# Altium schematic sheet CANnode.SchDoc
size 711 x 609 mm
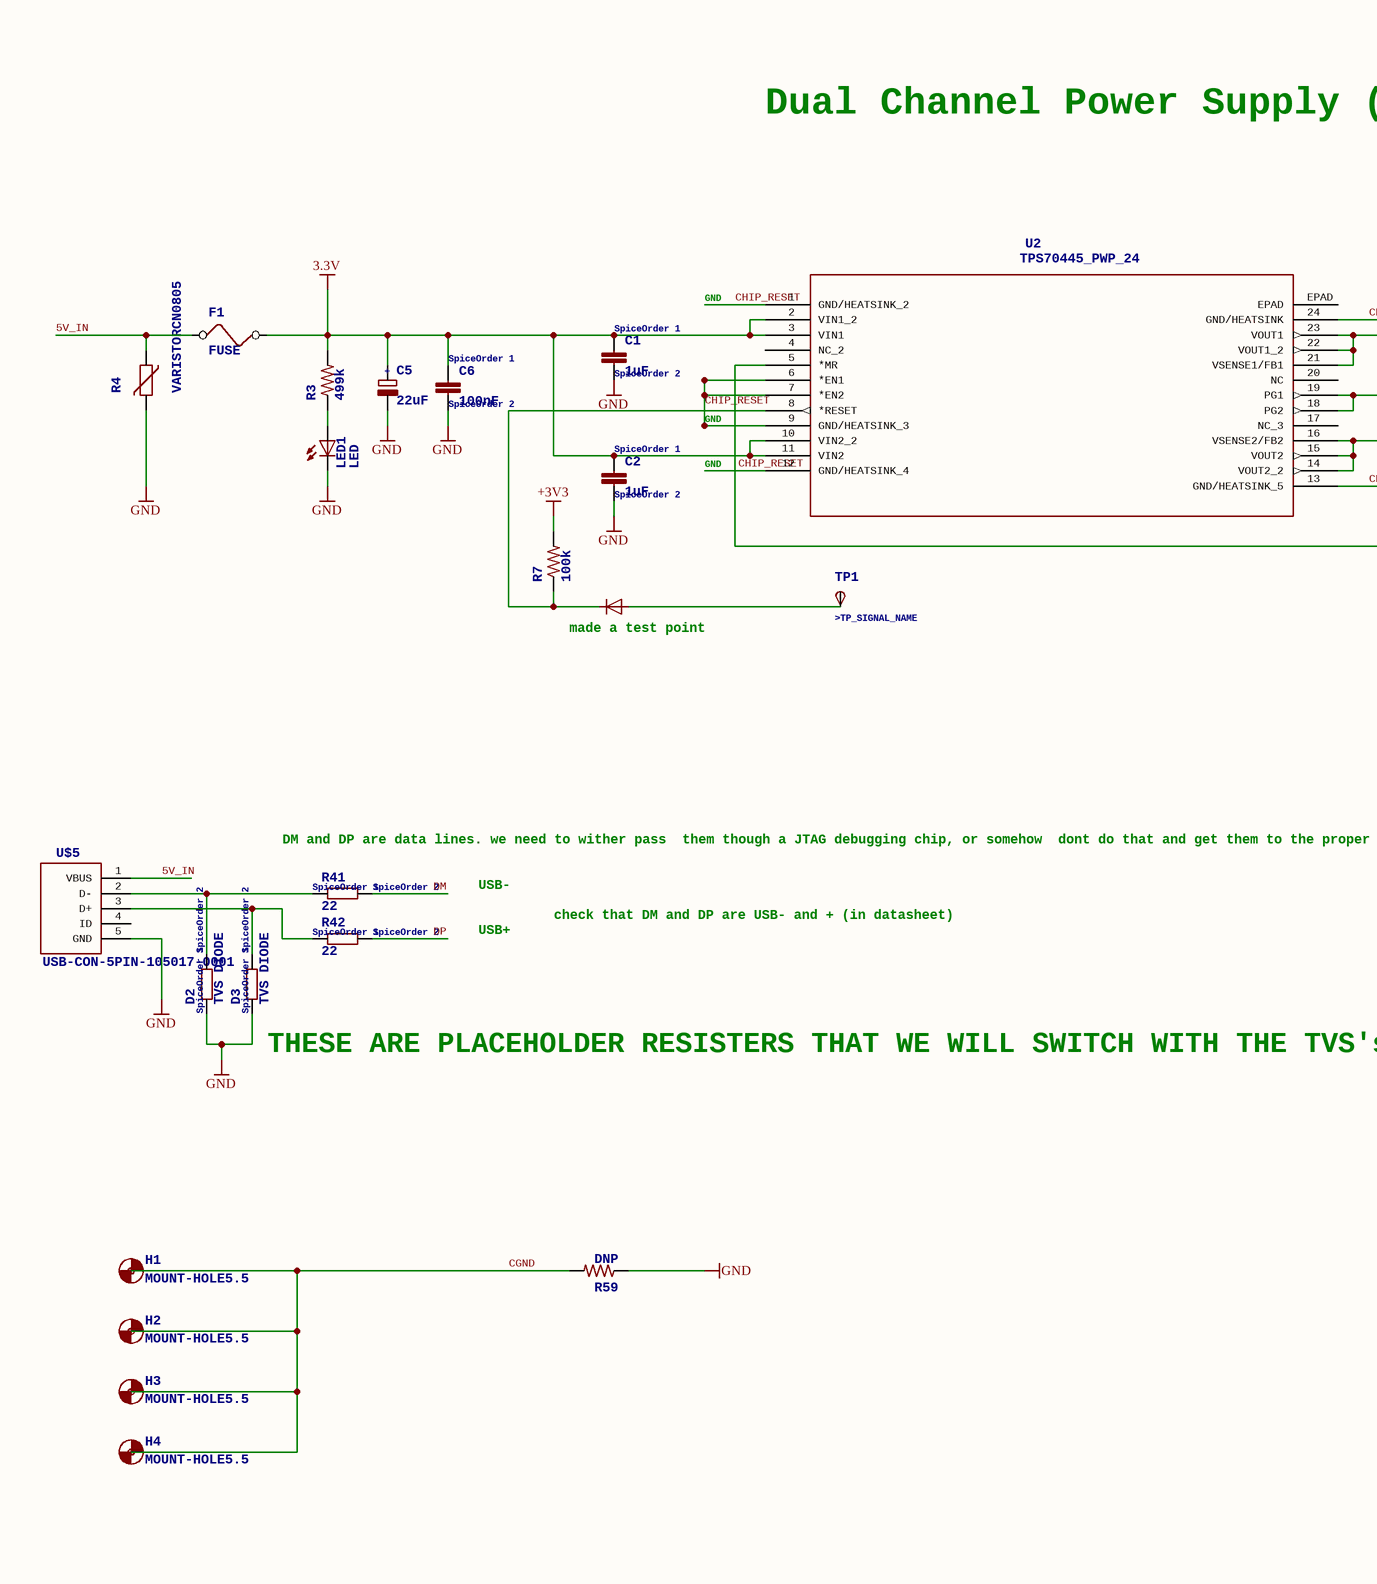
[diagram p0: CANnode.SchDoc, top left]
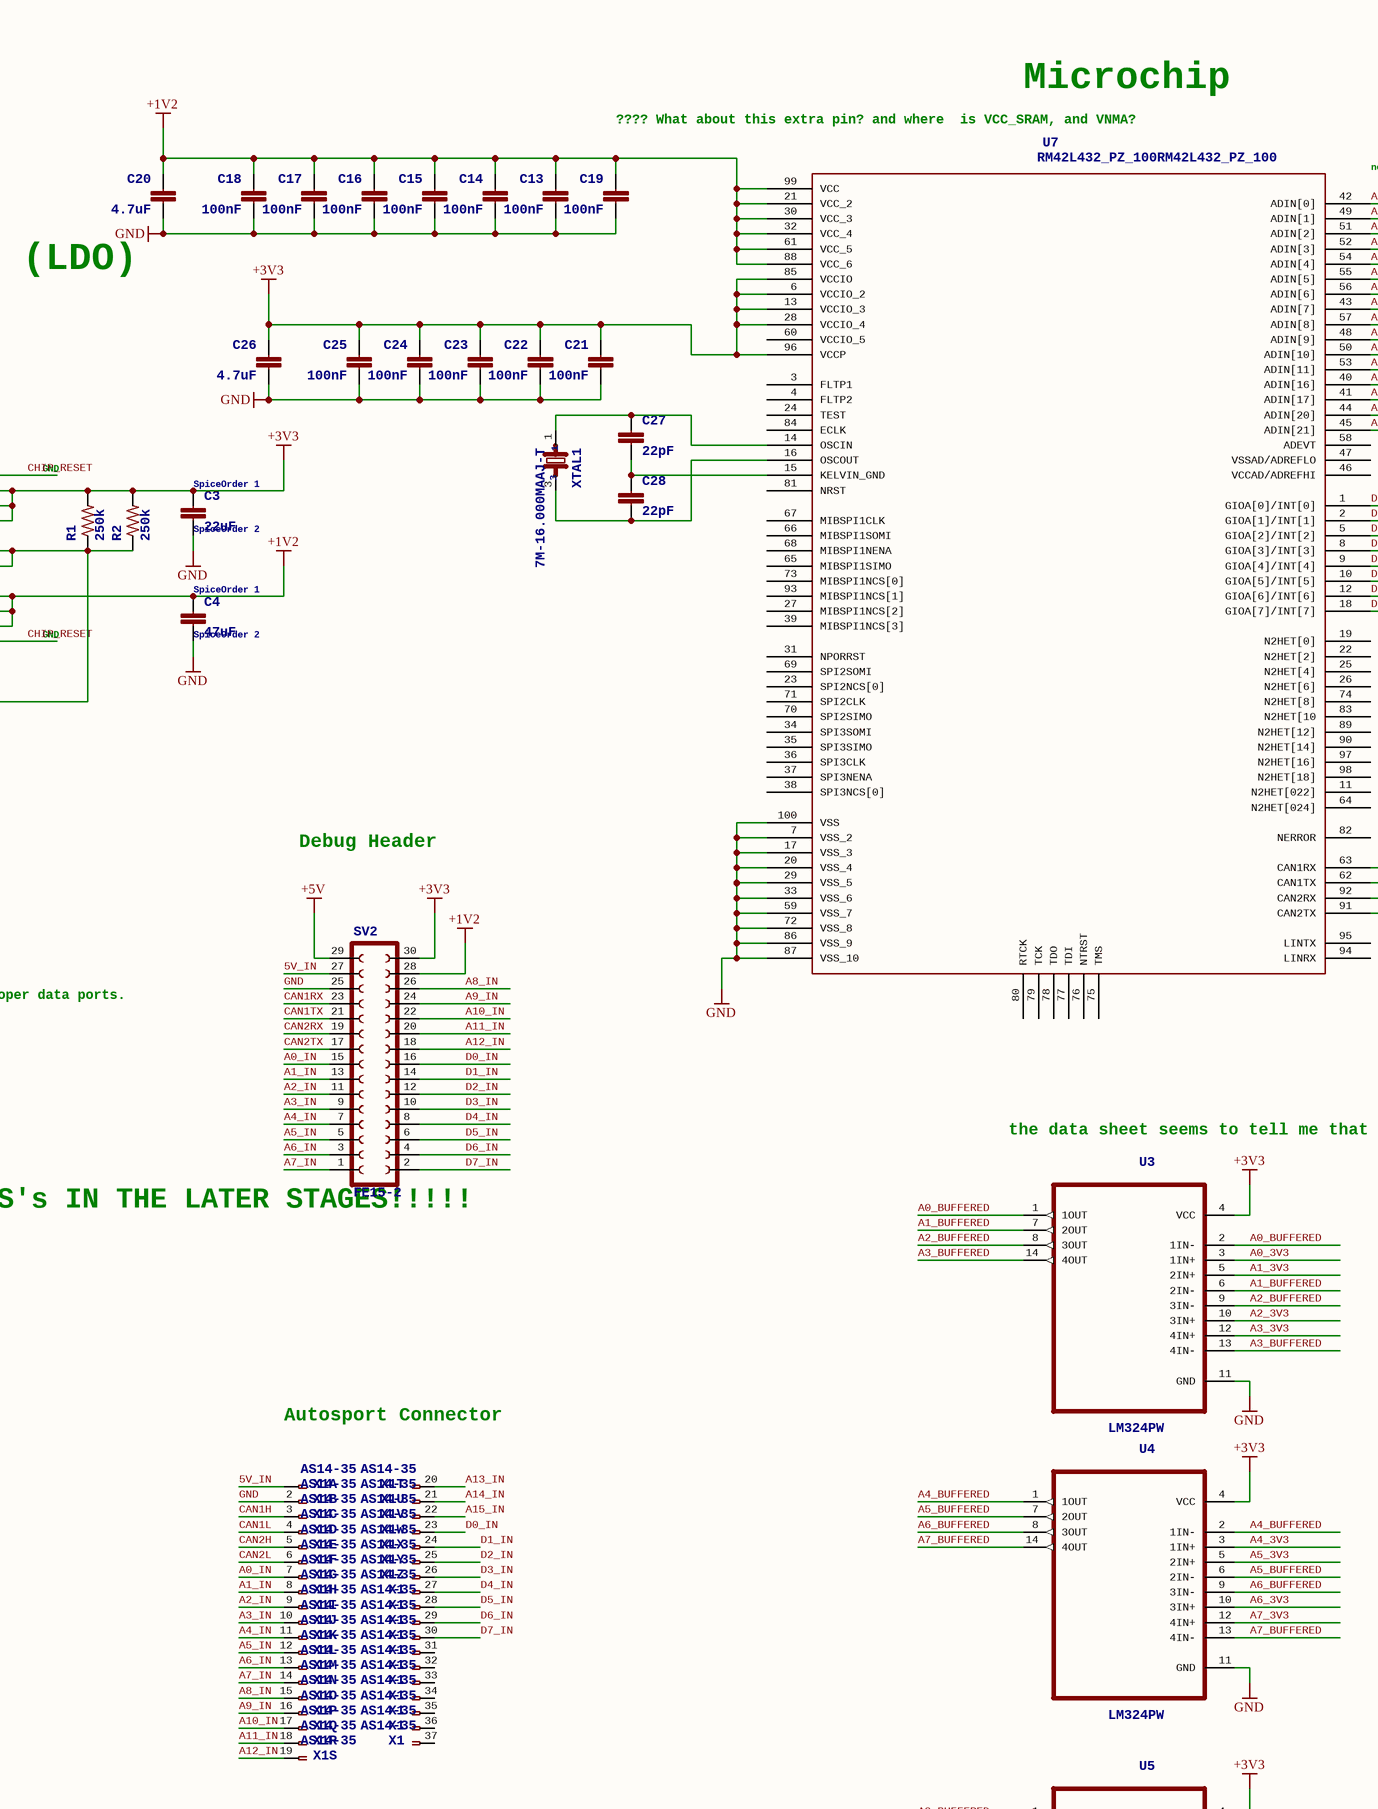
[diagram p1: CANnode.SchDoc, top middle]
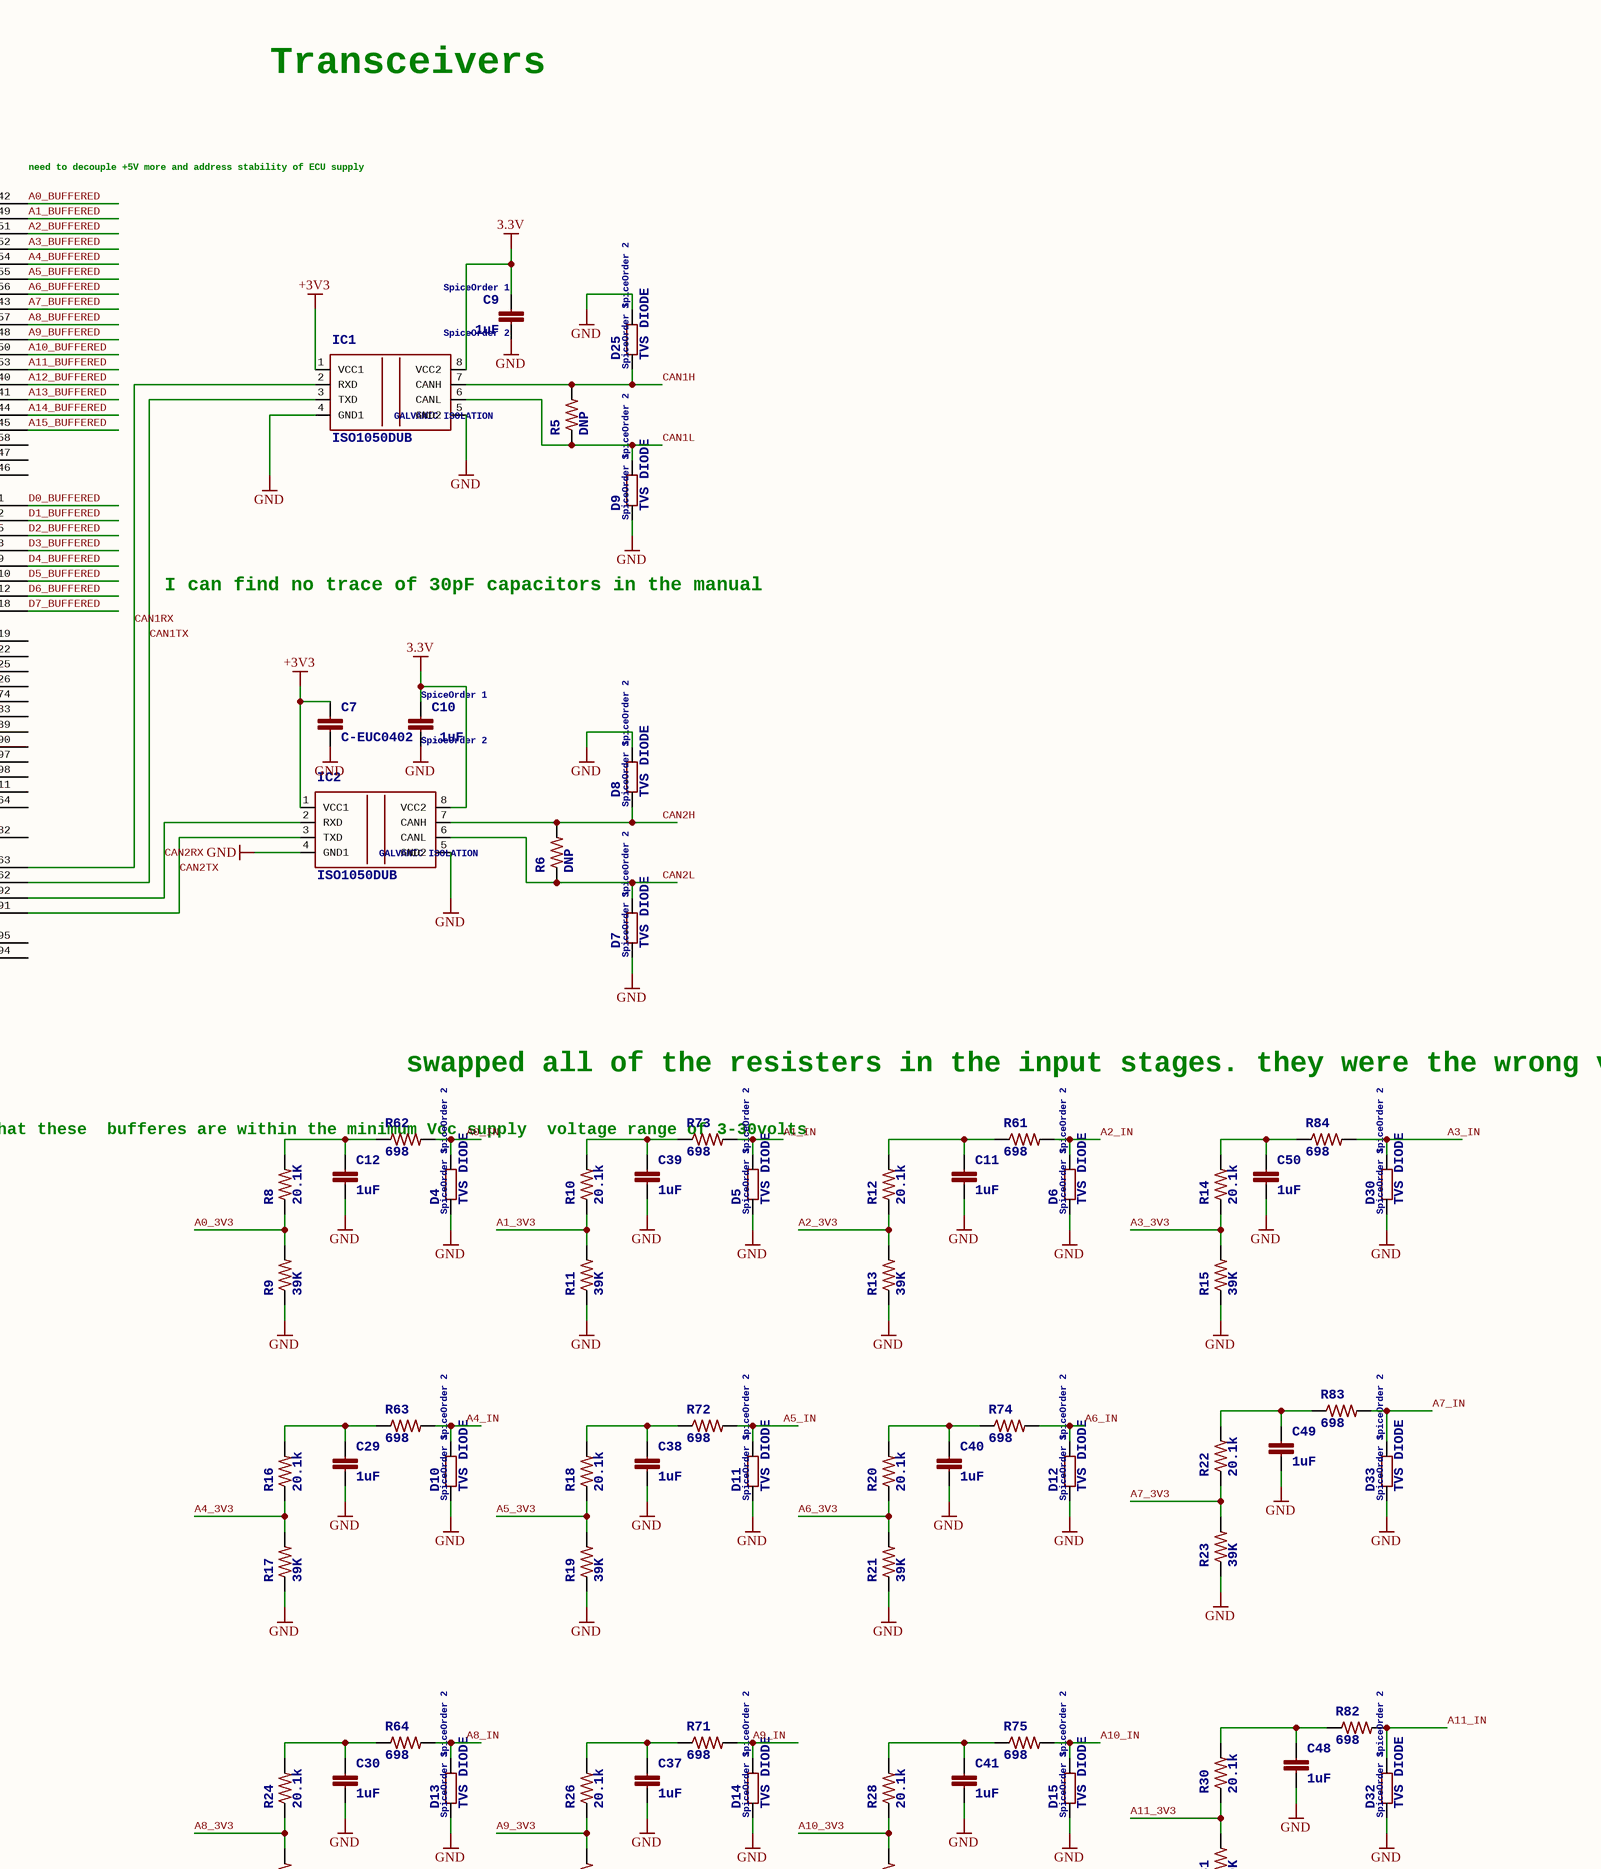
[diagram p2: CANnode.SchDoc, top right]
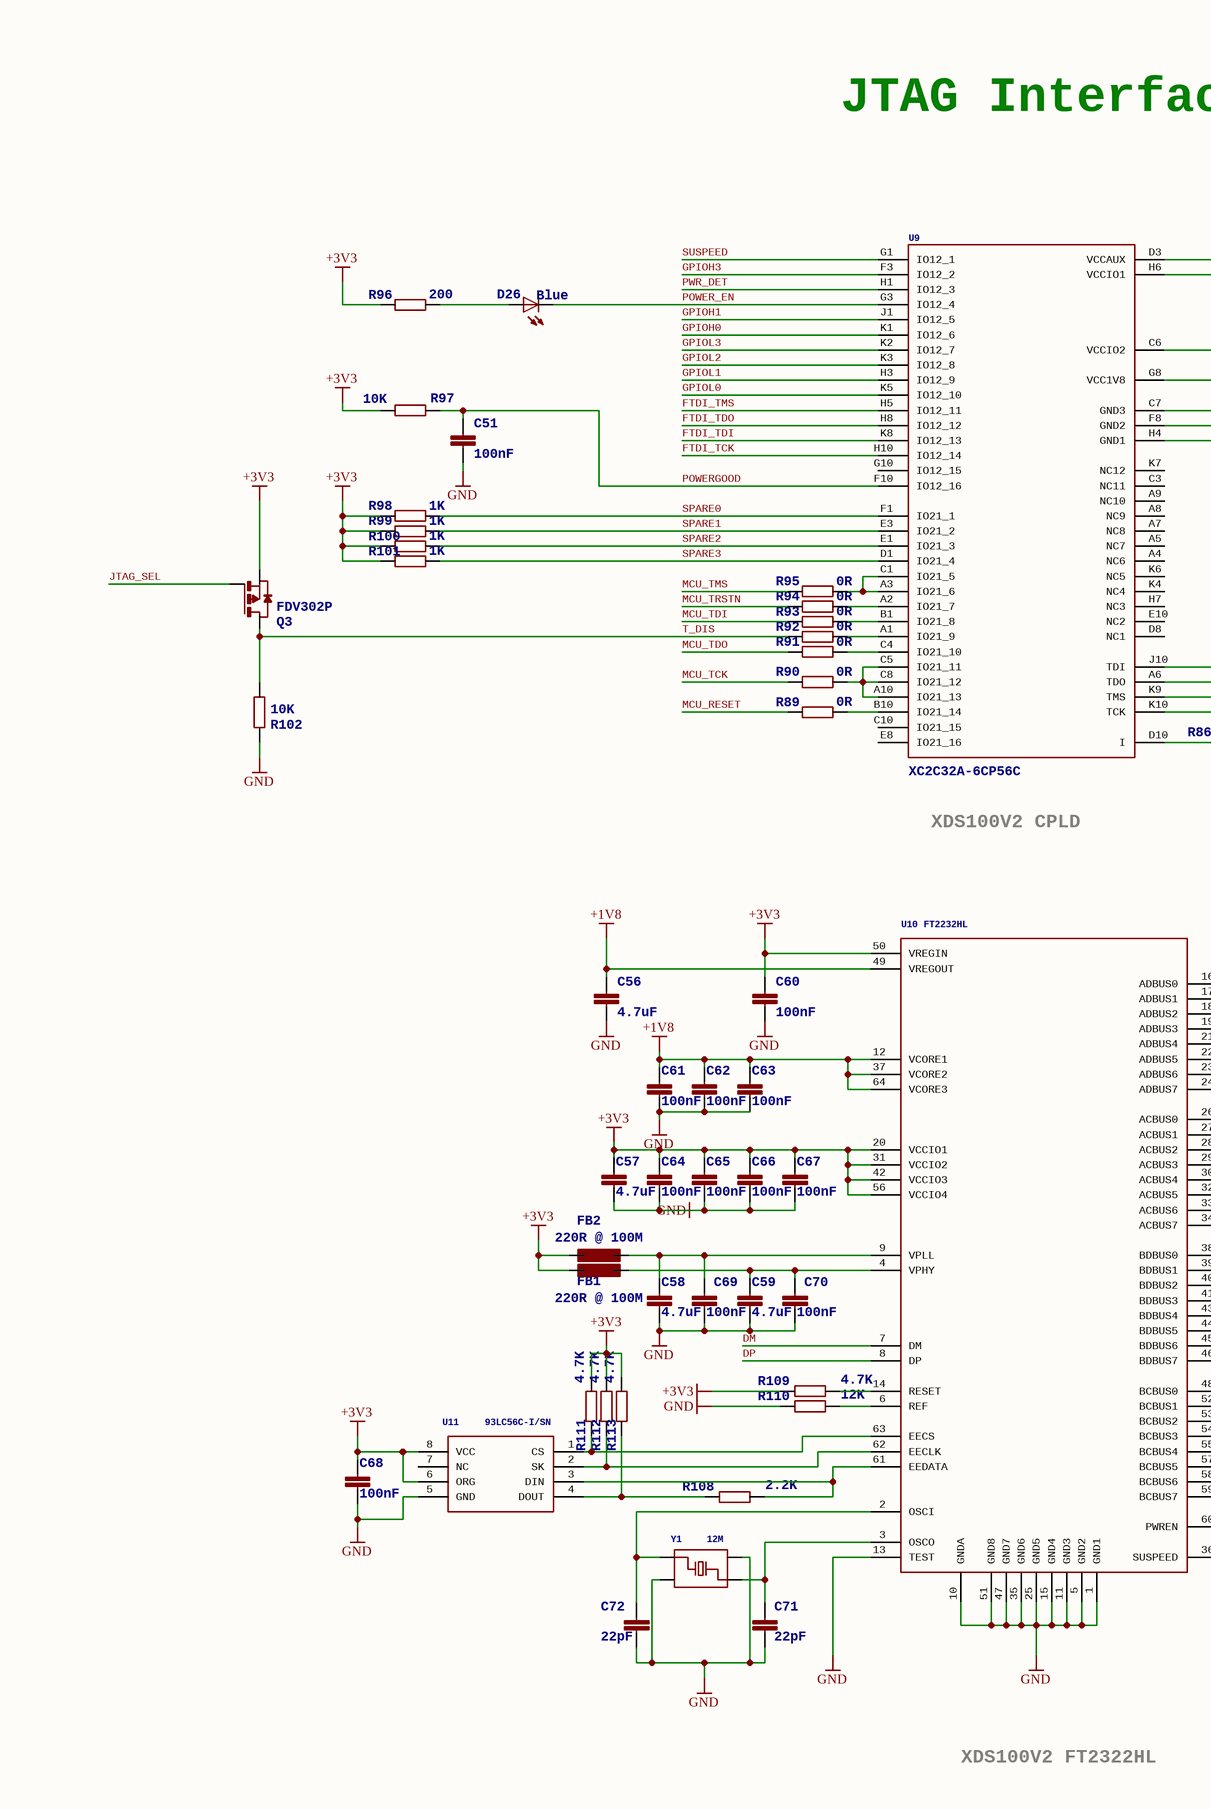
[diagram p3: CANnode.SchDoc, bottom left]
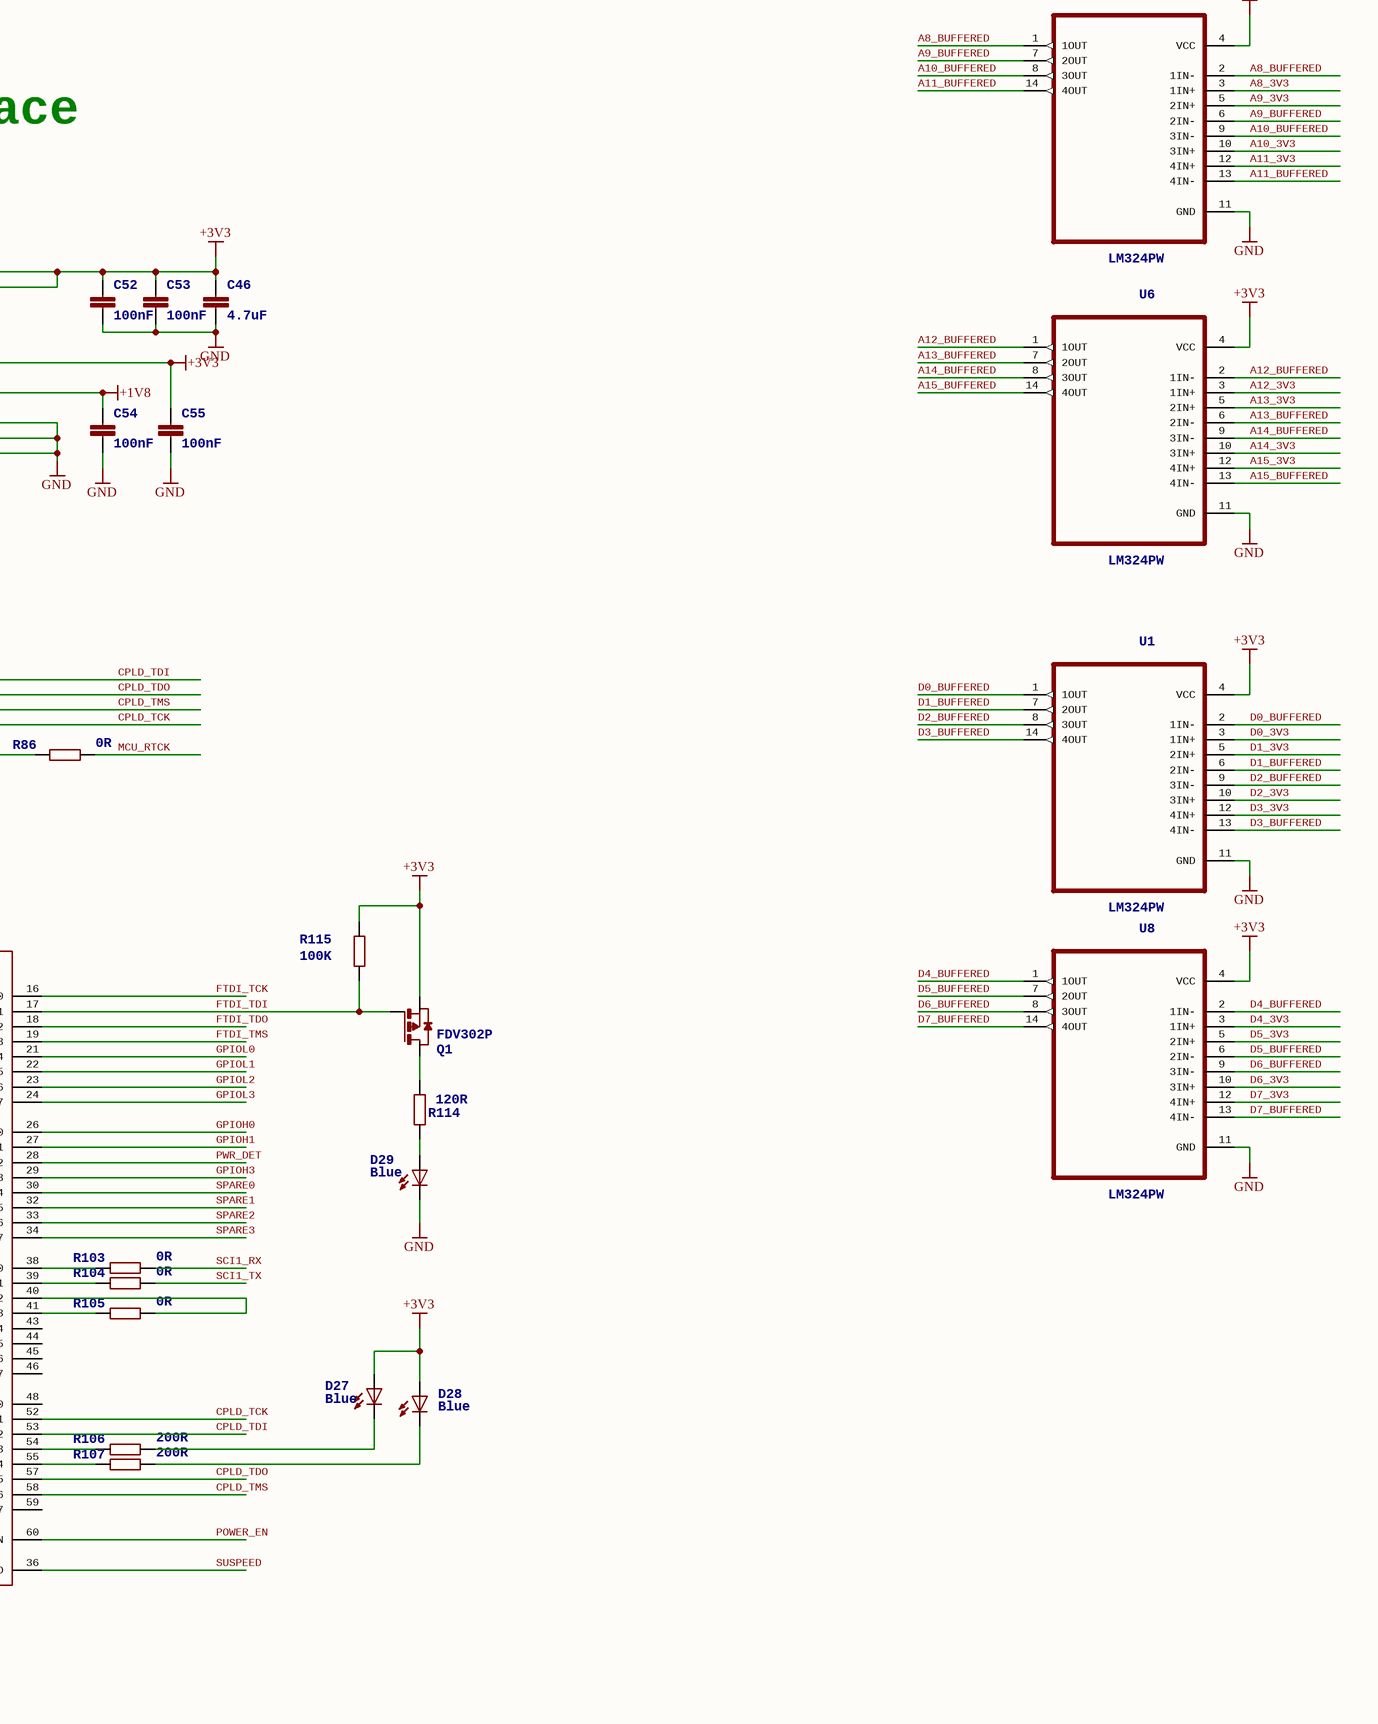
[diagram p4: CANnode.SchDoc, bottom middle]
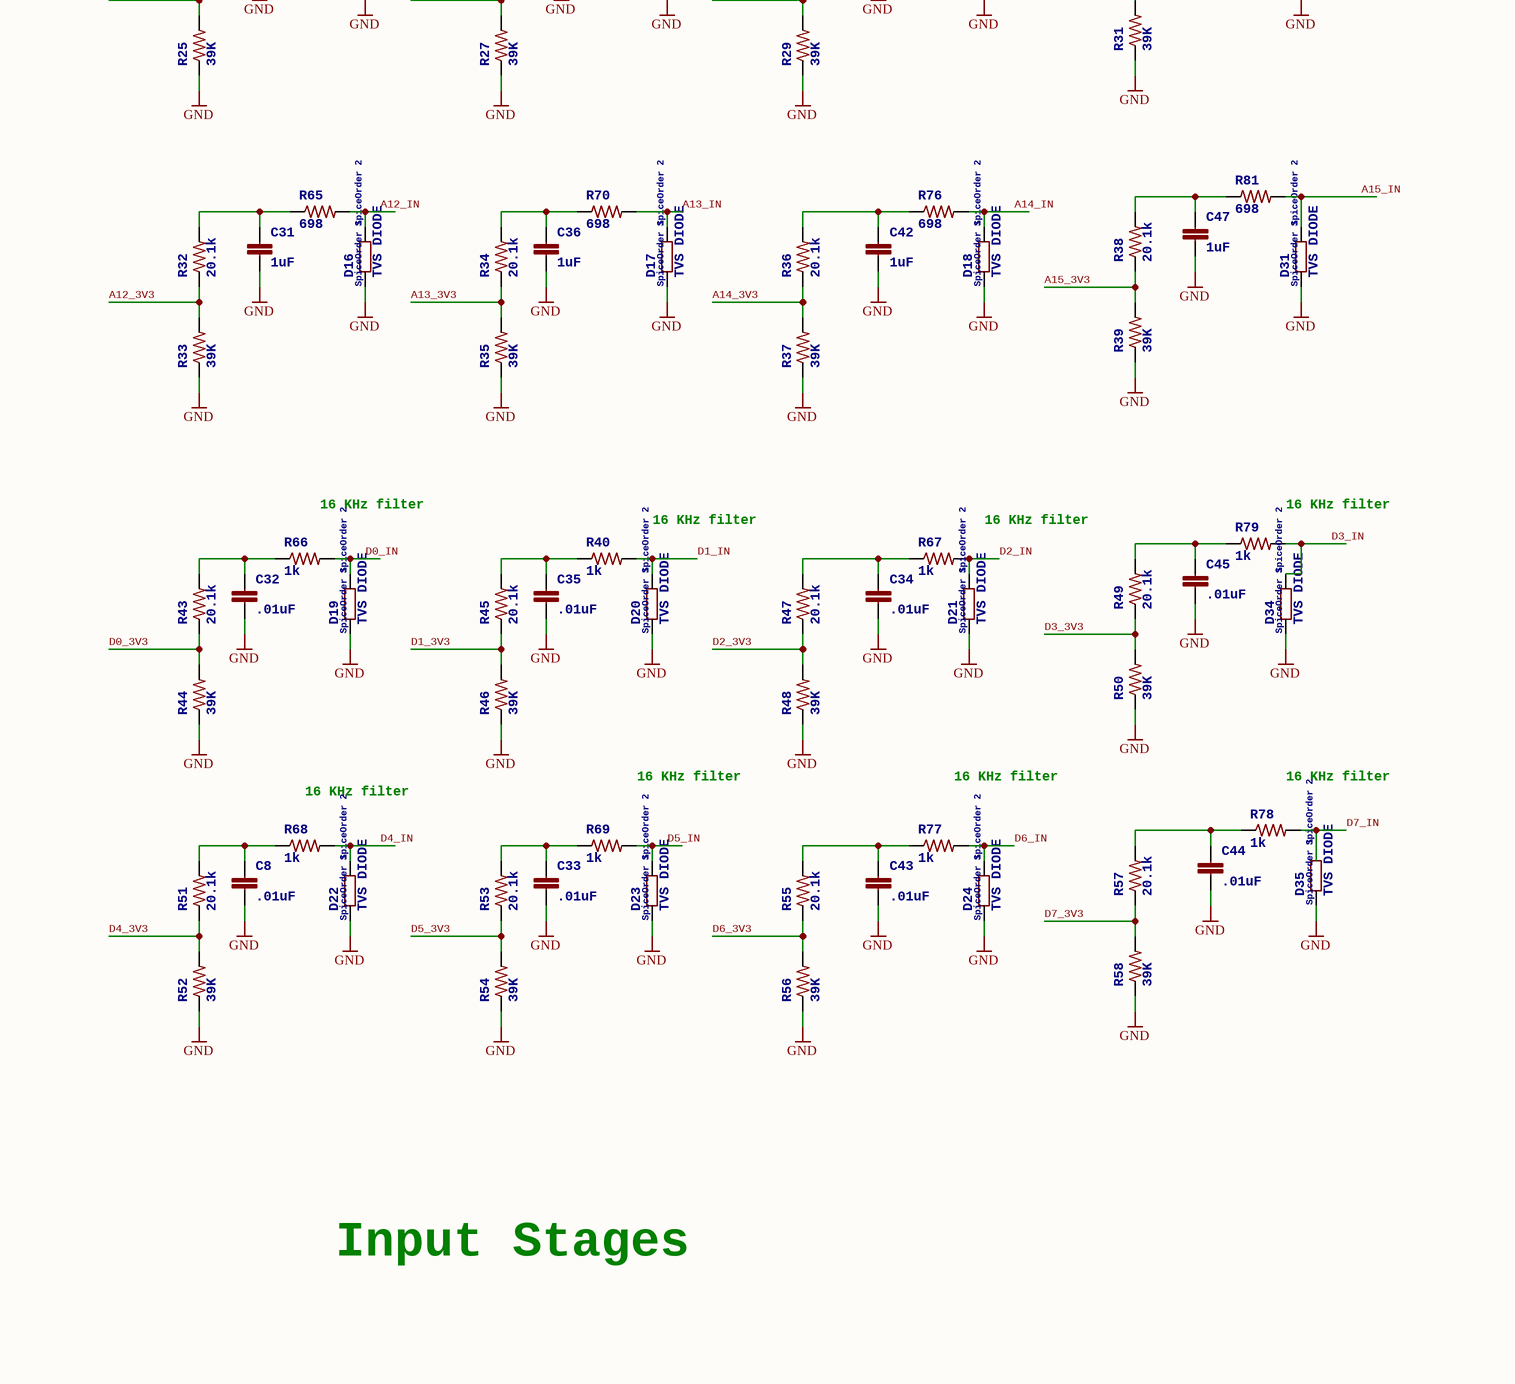
[diagram p5: CANnode.SchDoc, bottom right]

## Parts
C1  1uF  [C0402]
C2  1uF  [C0402]
C3  22uF  [C0402]
C4  47uF  [C0402]
C5  22uF  [CT3528]
C6  100nF  [C0402]
C7  C-EUC0402  [C0402]
C8  .01uF  [C0402]
C9  .1uF  [C0402]
C10  .1uF  [C0402]
C11  1uF  [C0402]
C12  1uF  [C0402]
C13  100nF  [C0402]
C14  100nF  [C0402]
C15  100nF  [C0402]
C16  100nF  [C0402]
C17  100nF  [C0402]
C18  100nF  [C0402]
C19  100nF  [C0402]
C20  4.7uF  [C0805]
C21  100nF  [C0402]
C22  100nF  [C0402]
C23  100nF  [C0402]
C24  100nF  [C0402]
C25  100nF  [C0402]
C26  4.7uF  [C0805]
C27  22pF  [C0402]
C28  22pF  [C0402]
C29  1uF  [C0402]
C30  1uF  [C0402]
C31  1uF  [C0402]
C32  .01uF  [C0402]
C33  .01uF  [C0402]
C34  .01uF  [C0402]
C35  .01uF  [C0402]
C36  1uF  [C0402]
C37  1uF  [C0402]
C38  1uF  [C0402]
C39  1uF  [C0402]
C40  1uF  [C0402]
C41  1uF  [C0402]
C42  1uF  [C0402]
C43  .01uF  [C0402]
C44  .01uF  [C0402]
C45  .01uF  [C0402]
C46  4.7uF  [0805]
C47  1uF  [C0402]
C48  1uF  [C0402]
C49  1uF  [C0402]
C50  1uF  [C0402]
C51  100nF  [0402]
C52  100nF  [0402]
C53  100nF  [0402]
C54  100nF  [0402]
C55  100nF  [0402]
C56  4.7uF  [0805]
C57  4.7uF  [0805]
C58  4.7uF  [0805]
C59  4.7uF  [0805]
C60  100nF  [0402]
C61  100nF  [0402]
C62  100nF  [0402]
C63  100nF  [0402]
C64  100nF  [0402]
C65  100nF  [0402]
C66  100nF  [0402]
C67  100nF  [0402]
C68  100nF  [0402]
C69  100nF  [0402]
C70  100nF  [0402]
C71  22pF  [0402]
C72  22pF  [0402]
D1  DIODE  (value not drawn)
D2  TVS DIODE  [R0402]
D3  TVS DIODE  [R0402]
D4  TVS DIODE  [R0402]
D5  TVS DIODE  [R0402]
D6  TVS DIODE  [R0402]
D7  TVS DIODE  [R0402]
D8  TVS DIODE  [R0402]
D9  TVS DIODE  [R0402]
D10  TVS DIODE  [R0402]
D11  TVS DIODE  [R0402]
D12  TVS DIODE  [R0402]
D13  TVS DIODE  [R0402]
D14  TVS DIODE  [R0402]
D15  TVS DIODE  [R0402]
D16  TVS DIODE  [R0402]
D17  TVS DIODE  [R0402]
D18  TVS DIODE  [R0402]
D19  TVS DIODE  [R0402]
D20  TVS DIODE  [R0402]
D21  TVS DIODE  [R0402]
D22  TVS DIODE  [R0402]
D23  TVS DIODE  [R0402]
D24  TVS DIODE  [R0402]
D25  TVS DIODE  [R0402]
D26  Blue  [LED0805]
D27  Blue  [LED0805]
D28  Blue  [LED0805]
D29  Blue  [LED0805]
D30  TVS DIODE  [R0402]
D31  TVS DIODE  [R0402]
D32  TVS DIODE  [R0402]
D33  TVS DIODE  [R0402]
D34  TVS DIODE  [R0402]
D35  TVS DIODE  [R0402]
F1  FUSE  [FUSE]
FB1  220R @ 100M  [0805]
FB2  220R @ 100M  [0805]
H1  MOUNT-HOLE5.5  [5,5]
H2  MOUNT-HOLE5.5  [5,5]
H3  MOUNT-HOLE5.5  [5,5]
H4  MOUNT-HOLE5.5  [5,5]
IC1  ISO1050DUB  [DUB-R-PDSO-G8]
IC2  ISO1050DUB  [DUB-R-PDSO-G8]
LED1  LED  [SMARTLED-TTW]
Q1  FDV302P  [SOT-23]
Q3  FDV302P  [SOT-23]
R1  250k  [R0402]
R2  250k  [R0402]
R3  499k  [R0402]
R4  VARISTORCN0805  [CT/CN0805]
R5  DNP  [R0402]
R6  DNP  [R0402]
R7  100k  [R0402]
R8  20.1K  [R0402]
R9  39K  [R0402]
R10  20.1k  [R0402]
R11  39K  [R0402]
R12  20.1k  [R0402]
R13  39K  [R0402]
R14  20.1k  [R0402]
R15  39K  [R0402]
R16  20.1k  [R0402]
R17  39K  [R0402]
R18  20.1k  [R0402]
R19  39K  [R0402]
R20  20.1k  [R0402]
R21  39K  [R0402]
R22  20.1k  [R0402]
R23  39K  [R0402]
R24  20.1k  [R0402]
R25  39K  [R0402]
R26  20.1k  [R0402]
R27  39K  [R0402]
R28  20.1k  [R0402]
R29  39K  [R0402]
R30  20.1k  [R0402]
R31  39K  [R0402]
R32  20.1k  [R0402]
R33  39K  [R0402]
R34  20.1k  [R0402]
R35  39K  [R0402]
R36  20.1k  [R0402]
R37  39K  [R0402]
R38  20.1k  [R0402]
R39  39K  [R0402]
R40  1k  [R0402]
R41  22  [R0402]
R42  22  [R0402]
R43  20.1k  [R0402]
R44  39K  [R0402]
R45  20.1k  [R0402]
R46  39K  [R0402]
R47  20.1k  [R0402]
R48  39K  [R0402]
R49  20.1k  [R0402]
R50  39K  [R0402]
R51  20.1k  [R0402]
R52  39K  [R0402]
R53  20.1k  [R0402]
R54  39K  [R0402]
R55  20.1k  [R0402]
R56  39K  [R0402]
R57  20.1k  [R0402]
R58  39K  [R0402]
R59  DNP  [R0402]
R61  698  [R0402]
R62  698  [R0402]
R63  698  [R0402]
R64  698  [R0402]
R65  698  [R0402]
R66  1k  [R0402]
R67  1k  [R0402]
R68  1k  [R0402]
R69  1k  [R0402]
R70  698  [R0402]
R71  698  [R0402]
R72  698  [R0402]
R73  698  [R0402]
R74  698  [R0402]
R75  698  [R0402]
R76  698  [R0402]
R77  1k  [R0402]
R78  1k  [R0402]
R79  1k  [R0402]
R81  698  [R0402]
R82  698  [R0402]
R83  698  [R0402]
R84  698  [R0402]
R86  0R  [0402]
R89  0R  [0402]
R90  0R  [0402]
R91  0R  [0402]
R92  0R  [0402]
R93  0R  [0402]
R94  0R  [0402]
R95  0R  [0402]
R96  200  [0402]
R97  10K  [0402]
R98  1K  [0402]
R99  1K  [0402]
R100  1K  [0402]
R101  1K  [0402]
R102  10K  [0402]
R103  0R  [0402]
R104  0R  [0402]
R105  0R  [0402]
R106  200R  [0402]
R107  200R  [0402]
R108  2.2K  [0402]
R109  4.7K  [0402]
R110  12K  [0402]
R111  4.7K  [0402]
R112  4.7K  [0402]
R113  4.7K  [0402]
R114  120R  [0402]
R115  100K  [0402]
SV2  FE15-2  [FE15-2]
TP1  TP_SIGNAL_NAME: >TP_SIGNAL_NAME  [B1,27]  (hidden comment: TPSB1,27)
U1  LM324PW  [SOP65P640X120-14N]
U2  TPS70445_PWP_24  [PWP24_4P68X2P4]
U3  LM324PW  [SOP65P640X120-14N]
U4  LM324PW  [SOP65P640X120-14N]
U5  LM324PW  [SOP65P640X120-14N]
U6  LM324PW  [SOP65P640X120-14N]
U7  RM42L432_PZ_100RM42L432_PZ_100  [PZ100]
U8  LM324PW  [SOP65P640X120-14N]
U9  XC2C32A-6CP56C  [CP56]
U10  FT2232HL  [LQFP64]
U11  93LC56C-I/SN  [SO8]
U$5  USB-CON-5PIN-105017-0001  [USB-MICRO-MOLEX-105017-0001]
X1  AS14-35  [AS14-35]  (parts A,B,C,D,E,F,G,H,I,J,K,L,M,N,O,P,Q,R,S,T,U,V,W,X,Y,Z,27,28,29,30,31,32,33,34,35,36,37 of 37)
XTAL1  7M-16.000MAAJ-T  [TXC_7M-16.000MAAJ-T]
Y1  12M  [CRYSTAL_3225]

## Nets
3.3V: C1.1 C2.1 C5.-(+) C6.1 C9.1 C10.1 F1.2 IC1.8(VCC2) IC2.8(VCC2) R3.2 U2.2(VIN1_2) U2.3(VIN1) U2.10(VIN2_2) U2.11(VIN2)
+1V2: C4.1 C13.1 C14.1 C15.1 C16.1 C17.1 C18.1 C19.1 C20.1 SV2.28 U2.14(VOUT2_2) U2.15(VOUT2) U2.16(VSENSE2/FB2) U7.21(VCC_2) U7.30(VCC_3) U7.32(VCC_4) U7.61(VCC_5) U7.88(VCC_6) U7.99(VCC)
+1V8: C54.1 C56.1 C61.1 C62.1 C63.1 U9.G8(VCC1V8) U10.12(VCORE1) U10.37(VCORE2) U10.49(VREGOUT) U10.64(VCORE3)
+3V3: C3.1 C7.1 C21.1 C22.1 C23.1 C24.1 C25.1 C26.1 C46.1 C52.1 C53.1 C55.1 C57.1 C60.1 C64.1 C65.1 C66.1 C67.1 C68.1 D27.A D28.A FB1.1 FB2.1 IC1.1(VCC1) IC2.1(VCC1) Q1.2(S) Q3.2(S) R1.2 R2.2 R7.2 R96.1 R97.2 R98.1 R99.1 R100.1 R101.1 R109.1 R111.2 R112.2 R113.2 R115.2 SV2.30 U1.4(VCC) U2.21(VSENSE1/FB1) U2.22(VOUT1_2) U2.23(VOUT1) U3.4(VCC) U4.4(VCC) U5.4(VCC) U6.4(VCC) U7.6(VCCIO_2) U7.13(VCCIO_3) U7.28(VCCIO_4) U7.85(VCCIO) U7.96(VCCP) U8.4(VCC) U9.C6(VCCIO2) U9.D3(VCCAUX) U9.H6(VCCIO1) U10.20(VCCIO1) U10.31(VCCIO2) U10.42(VCCIO3) U10.50(VREGIN) U10.56(VCCIO4) U11.6(ORG) U11.8(VCC)
+5V: SV2.29
GND: C1.2 C2.2 C3.2 C4.2 C5.+(-) C6.2 C7.2 C8.2 C9.2 C10.2 C11.2 C12.2 C13.2 C14.2 C15.2 C16.2 C17.2 C18.2 C19.2 C20.2 C21.2 C22.2 C23.2 C24.2 C25.2 C26.2 C29.2 C30.2 C31.2 C32.2 C33.2 C34.2 C35.2 C36.2 C37.2 C38.2 C39.2 C40.2 C41.2 C42.2 C43.2 C44.2 C45.2 C46.2 C47.2 C48.2 C49.2 C50.2 C51.2 C52.2 C53.2 C54.2 C55.2 C56.2 C57.2 C58.2 C59.2 C60.2 C61.2 C62.2 C63.2 C64.2 C65.2 C66.2 C67.2 C68.2 C69.2 C70.2 C71.2 C72.2 D2.1 D3.1 D4.1 D5.1 D6.1 D7.1 D8.2 D9.1 D10.1 D11.1 D12.1 D13.1 D14.1 D15.1 D16.1 D17.1 D18.1 D19.1 D20.1 D21.1 D22.1 D23.1 D24.1 D25.2 D29.C D30.1 D31.1 D32.1 D33.1 D34.1 D35.1 IC1.4(GND1) IC1.5(GND2) IC2.4(GND1) IC2.5(GND2) LED1.C@1(C) R4.2 R9.1 R11.1 R13.1 R15.1 R17.1 R19.1 R21.1 R23.1 R25.1 R27.1 R29.1 R31.1 R33.1 R35.1 R37.1 R39.1 R44.1 R46.1 R48.1 R50.1 R52.1 R54.1 R56.1 R58.1 R59.1 R102.1 R110.1 SV2.25 U1.11(GND) U3.11(GND) U4.11(GND) U5.11(GND) U6.11(GND) U7.7(VSS_2) U7.17(VSS_3) U7.20(VSS_4) U7.29(VSS_5) U7.33(VSS_6) U7.59(VSS_7) U7.72(VSS_8) U7.86(VSS_9) U7.87(VSS_10) U7.100(VSS) U8.11(GND) U9.C7(GND3) U9.F8(GND2) U9.H4(GND1) U10.1(GND1) U10.5(GND2) U10.10(GNDA) U10.11(GND3) U10.13(TEST) U10.15(GND4) U10.25(GND5) U10.35(GND6) U10.47(GND7) U10.51(GND8) U11.5(GND) U$5.5(GND) X1.2 Y1.P$2 Y1.P$4
5V_IN: F1.1 R4.1 SV2.27 U$5.1(VBUS) X1.1
A0_3V3: R8.1 R9.2 U3.3(1IN+)
A0_BUFFERED: U3.1(1OUT) U3.2(1IN-) U7.42(ADIN[0])
A0_IN: D4.2 R62.2 SV2.15 X1.7
A1_3V3: R10.1 R11.2 U3.5(2IN+)
A1_BUFFERED: U3.6(2IN-) U3.7(2OUT) U7.49(ADIN[1])
A1_IN: D5.2 R73.2 SV2.13 X1.8
A2_3V3: R12.1 R13.2 U3.10(3IN+)
A2_BUFFERED: U3.8(3OUT) U3.9(3IN-) U7.51(ADIN[2])
A2_IN: D6.2 R61.2 SV2.11 X1.9
A3_3V3: R14.1 R15.2 U3.12(4IN+)
A3_BUFFERED: U3.13(4IN-) U3.14(4OUT) U7.52(ADIN[3])
A3_IN: D30.2 R84.2 SV2.9 X1.10
A4_3V3: R16.1 R17.2 U4.3(1IN+)
A4_BUFFERED: U4.1(1OUT) U4.2(1IN-) U7.54(ADIN[4])
A4_IN: D10.2 R63.2 SV2.7 X1.11
A5_3V3: R18.1 R19.2 U4.5(2IN+)
A5_BUFFERED: U4.6(2IN-) U4.7(2OUT) U7.55(ADIN[5])
A5_IN: D11.2 R72.2 SV2.5 X1.12
A6_3V3: R20.1 R21.2 U4.10(3IN+)
A6_BUFFERED: U4.8(3OUT) U4.9(3IN-) U7.56(ADIN[6])
A6_IN: D12.2 R74.2 SV2.3 X1.13
A7_3V3: R22.1 R23.2 U4.12(4IN+)
A7_BUFFERED: U4.13(4IN-) U4.14(4OUT) U7.43(ADIN[7])
A7_IN: D33.2 R83.2 SV2.1 X1.14
A8_3V3: R24.1 R25.2 U5.3(1IN+)
A8_BUFFERED: U5.1(1OUT) U5.2(1IN-) U7.57(ADIN[8])
A8_IN: D13.2 R64.2 SV2.26 X1.15
A9_3V3: R26.1 R27.2 U5.5(2IN+)
A9_BUFFERED: U5.6(2IN-) U5.7(2OUT) U7.48(ADIN[9])
A9_IN: D14.2 R71.2 SV2.24 X1.16
A10_3V3: R28.1 R29.2 U5.10(3IN+)
A10_BUFFERED: U5.8(3OUT) U5.9(3IN-) U7.50(ADIN[10])
A10_IN: D15.2 R75.2 SV2.22 X1.17
A11_3V3: R30.1 R31.2 U5.12(4IN+)
A11_BUFFERED: U5.13(4IN-) U5.14(4OUT) U7.53(ADIN[11])
A11_IN: D32.2 R82.2 SV2.20 X1.18
A12_3V3: R32.1 R33.2 U6.3(1IN+)
A12_BUFFERED: U6.1(1OUT) U6.2(1IN-) U7.40(ADIN[16])
A12_IN: D16.2 R65.2 SV2.18 X1.19
A13_3V3: R34.1 R35.2 U6.5(2IN+)
A13_BUFFERED: U6.6(2IN-) U6.7(2OUT) U7.41(ADIN[17])
A13_IN: D17.2 R70.2 X1.20
A14_3V3: R36.1 R37.2 U6.10(3IN+)
A14_BUFFERED: U6.8(3OUT) U6.9(3IN-) U7.44(ADIN[20])
A14_IN: D18.2 R76.2 X1.21
A15_3V3: R38.1 R39.2 U6.12(4IN+)
A15_BUFFERED: U6.13(4IN-) U6.14(4OUT) U7.45(ADIN[21])
A15_IN: D31.2 R81.2 X1.22
CAN1H: D25.1 IC1.7(CANH) R5.2 X1.3
CAN1L: D9.2 IC1.6(CANL) R5.1 X1.4
CAN1RX: IC1.2(RXD) SV2.23 U7.63(CAN1RX)
CAN1TX: IC1.3(TXD) SV2.21 U7.62(CAN1TX)
CAN2H: D8.1 IC2.7(CANH) R6.2 X1.5
CAN2L: D7.2 IC2.6(CANL) R6.1 X1.6
CAN2RX: IC2.2(RXD) SV2.19 U7.92(CAN2RX)
CAN2TX: IC2.3(TXD) SV2.17 U7.91(CAN2TX)
CGND: R59.2
CHIP_RESET: U2.1(GND/HEATSINK_2) U2.6(*EN1) U2.7(*EN2) U2.9(GND/HEATSINK_3) U2.12(GND/HEATSINK_4) U2.13(GND/HEATSINK_5) U2.24(GND/HEATSINK)
CPLD_TCK: U9.K10(TCK) U10.52(BCBUS1)
CPLD_TDI: U9.J10(TDI) U10.53(BCBUS2)
CPLD_TDO: U9.A6(TDO) U10.57(BCBUS5)
CPLD_TMS: U9.K9(TMS) U10.58(BCBUS6)
D0_3V3: R43.1 R44.2 U1.3(1IN+)
D0_BUFFERED: U1.1(1OUT) U1.2(1IN-) U7.1(GIOA[0]/INT[0])
D0_IN: D19.2 R66.2 SV2.16 X1.23
D1_3V3: R45.1 R46.2 U1.5(2IN+)
D1_BUFFERED: U1.6(2IN-) U1.7(2OUT) U7.2(GIOA[1]/INT[1])
D1_IN: D20.2 R40.2 SV2.14 X1.24
D2_3V3: R47.1 R48.2 U1.10(3IN+)
D2_BUFFERED: U1.8(3OUT) U1.9(3IN-) U7.5(GIOA[2]/INT[2])
D2_IN: D21.2 R67.2 SV2.12 X1.25
D3_3V3: R49.1 R50.2 U1.12(4IN+)
D3_BUFFERED: U1.13(4IN-) U1.14(4OUT) U7.8(GIOA[3]/INT[3])
D3_IN: D34.2 R79.2 SV2.10 X1.26
D4_3V3: R51.1 R52.2 U8.3(1IN+)
D4_BUFFERED: U7.9(GIOA[4]/INT[4]) U8.1(1OUT) U8.2(1IN-)
D4_IN: D22.2 R68.2 SV2.8 X1.27
D5_3V3: R53.1 R54.2 U8.5(2IN+)
D5_BUFFERED: U7.10(GIOA[5]/INT[5]) U8.6(2IN-) U8.7(2OUT)
D5_IN: D23.2 R69.2 SV2.6 X1.28
D6_3V3: R55.1 R56.2 U8.10(3IN+)
D6_BUFFERED: U7.12(GIOA[6]/INT[6]) U8.8(3OUT) U8.9(3IN-)
D6_IN: D24.2 R77.2 SV2.4 X1.29
D7_3V3: R57.1 R58.2 U8.12(4IN+)
D7_BUFFERED: U7.18(GIOA[7]/INT[7]) U8.13(4IN-) U8.14(4OUT)
D7_IN: D35.2 R78.2 SV2.2 X1.30
DM: R41.2 U10.7(DM)
DP: R42.2 U10.8(DP)
FTDI_TCK: U9.H10(IO12_14) U10.16(ADBUS0)
FTDI_TDI: Q1.3(G) R115.1 U9.K8(IO12_13) U10.17(ADBUS1)
FTDI_TDO: U9.H8(IO12_12) U10.18(ADBUS2)
FTDI_TMS: U9.H5(IO12_11) U10.19(ADBUS3)
GPIOH0: U9.K1(IO12_6) U10.26(ACBUS0)
GPIOH1: U9.J1(IO12_5) U10.27(ACBUS1)
GPIOH3: U9.F3(IO12_2) U10.29(ACBUS3)
GPIOL0: U9.K5(IO12_10) U10.21(ADBUS4)
GPIOL1: U9.H3(IO12_9) U10.22(ADBUS5)
GPIOL2: U9.K3(IO12_8) U10.23(ADBUS6)
GPIOL3: U9.K2(IO12_7) U10.24(ADBUS7)
JTAG_SEL: Q3.3(G)
MCU_RESET: R89.1
MCU_RTCK: R86.2
MCU_TCK: R90.1
MCU_TDI: R93.1
MCU_TDO: R91.1
MCU_TMS: R95.1
MCU_TRSTN: R94.1
POWER_EN: D26.C U9.G3(IO12_4) U10.60(PWREN)
POWERGOOD: C51.1 R97.1 U9.F10(IO12_16)
PWR_DET: U9.H1(IO12_3) U10.28(ACBUS2)
SCI1_RX: R103.2
SCI1_TX: R104.2
SPARE0: R98.2 U9.F1(IO21_1) U10.30(ACBUS4)
SPARE1: R99.2 U9.E3(IO21_2) U10.32(ACBUS5)
SPARE2: R100.2 U9.E1(IO21_3) U10.33(ACBUS6)
SPARE3: R101.2 U9.D1(IO21_4) U10.34(ACBUS7)
SUSPEED: U9.G1(IO12_1) U10.36(SUSPEED)
T_DIS: Q3.1(D) R92.1 R102.2
NetC8_1: C8.1 R51.2 R68.1
NetC11_1: C11.1 R12.2 R61.1
NetC12_1: C12.1 R8.2 R62.1
NetC27_1: C27.1 U7.14(OSCIN) XTAL1.1
NetC27_2: C27.2 C28.1 U7.15(KELVIN_GND)
NetC28_2: C28.2 U7.16(OSCOUT) XTAL1.3
NetC29_1: C29.1 R16.2 R63.1
NetC30_1: C30.1 R24.2 R64.1
NetC31_1: C31.1 R32.2 R65.1
NetC32_1: C32.1 R43.2 R66.1
NetC33_1: C33.1 R53.2 R69.1
NetC34_1: C34.1 R47.2 R67.1
NetC35_1: C35.1 R40.1 R45.2
NetC36_1: C36.1 R34.2 R70.1
NetC37_1: C37.1 R26.2 R71.1
NetC38_1: C38.1 R18.2 R72.1
NetC39_1: C39.1 R10.2 R73.1
NetC40_1: C40.1 R20.2 R74.1
NetC41_1: C41.1 R28.2 R75.1
NetC42_1: C42.1 R36.2 R76.1
NetC43_1: C43.1 R55.2 R77.1
NetC44_1: C44.1 R57.2 R78.1
NetC45_1: C45.1 R49.2 R79.1
NetC47_1: C47.1 R38.2 R81.1
NetC48_1: C48.1 R30.2 R82.1
NetC49_1: C49.1 R22.2 R83.1
NetC50_1: C50.1 R14.2 R84.1
NetC58_1: C58.1 C69.1 FB1.2 U10.9(VPLL)
NetC59_1: C59.1 C70.1 FB2.2 U10.4(VPHY)
NetC71_1: C71.1 U10.3(OSCO) Y1.P$1
NetC72_1: C72.1 U10.2(OSCI) Y1.P$3
NetD2_2: D2.2 R41.1 U$5.2(D-)
NetD3_2: D3.2 R42.1 U$5.3(D+)
NetD26_A: D26.A R96.2
NetD27_C: D27.C R106.2
NetD28_C: D28.C R107.2
NetD29_A: D29.A R114.1
NetLED1_A@1: LED1.A@1(A) R3.1
NetQ1_1: Q1.1(D) R114.2
NetR1_1: R1.1 R2.1 U2.5(*MR) U2.18(PG2) U2.19(PG1)
NetR7_1: R7.1 U2.8(*RESET)
NetR86_1: R86.1 U9.D10(I)
NetR89_2: R89.2 U9.B10(IO21_14)
NetR90_2: R90.2 U9.A10(IO21_13) U9.C5(IO21_11) U9.C8(IO21_12)
NetR91_2: R91.2 U9.C4(IO21_10)
NetR92_2: R92.2 U9.A1(IO21_9)
NetR93_2: R93.2 U9.B1(IO21_8)
NetR94_2: R94.2 U9.A2(IO21_7)
NetR95_2: R95.2 U9.A3(IO21_6) U9.C1(IO21_5)
NetR103_1: R103.1 U10.38(BDBUS0)
NetR104_1: R104.1 U10.39(BDBUS1)
NetR105_1: R105.1 U10.41(BDBUS3)
NetR105_2: R105.2 U10.40(BDBUS2)
NetR106_1: R106.1 U10.54(BCBUS3)
NetR107_1: R107.1 U10.55(BCBUS4)
NetR108_1: R108.1 R113.1 U11.4(DOUT)
NetR108_2: R108.2 U10.61(EEDATA) U11.3(DIN)
NetR109_2: R109.2 U10.14(RESET)
NetR110_2: R110.2 U10.6(REF)
NetR111_1: R111.1 U10.63(EECS) U11.1(CS)
NetR112_1: R112.1 U10.62(EECLK) U11.2(SK)

Not connected (* = marked no-connect by the designer): TP1 TP(PP); U2 4(NC_2) 17(NC_3) 20(NC) EPAD; U7 3(FLTP1) 4(FLTP2) 11(N2HET[022]) 19(N2HET[0]) 22(N2HET[2]) 23(SPI2NCS[0]) 24(TEST) 25(N2HET[4]) 26(N2HET[6]) 27(MIBSPI1NCS[2]) 31(NPORRST) 34(SPI3SOMI) 35(SPI3SIMO) 36(SPI3CLK) 37(SPI3NENA) 38(SPI3NCS[0]) 39(MIBSPI1NCS[3]) 46(VCCAD/ADREFHI) 47(VSSAD/ADREFLO) 58(ADEVT) 60(VCCIO_5) 64(N2HET[024]) 65(MIBSPI1SIMO) 66(MIBSPI1SOMI) 67(MIBSPI1CLK) 68(MIBSPI1NENA) 69(SPI2SOMI) 70(SPI2SIMO) 71(SPI2CLK) 73(MIBSPI1NCS[0]) 74(N2HET[8]) 75(TMS) 76(NTRST) 77(TDI) 78(TDO) 79(TCK) 80(RTCK) 81(NRST) 82(NERROR) 83(N2HET[10) 84(ECLK) 89(N2HET[12]) 90(N2HET[14]) 93(MIBSPI1NCS[1]) 94(LINRX) 95(LINTX) 97(N2HET[16]) 98(N2HET[18]); U9 A4(NC6) A5(NC7) A7(NC8) A8(NC9) A9(NC10) C3(NC11) C10(IO21_15) D8(NC1) E8(IO21_16) E10(NC2) G10(IO12_15) H7(NC3) K4(NC4) K6(NC5) K7(NC12); U10 43(BDBUS4) 44(BDBUS5) 45(BDBUS6) 46(BDBUS7) 48(BCBUS0) 59(BCBUS7); U11 7(NC); U$5 4(ID); X1 31(1) 32(1) 33(1) 34(1) 35(1) 36(1) 37(1)

## Notes on the sheet
- Microchip
- Transceivers
- ???? What about this extra pin? and where
  is VCC_SRAM, and VNMA?
- (near U7) need to decouple +5V more and address stability of ECU supply
- Dual Channel Power Supply (LDO)
- GND
- (near R1) GND
- I can find no trace of 30pF capacitors in the manual
- (near D1) made a test point
- Debug Header
- (near R41) DM and DP are data lines. we need to wither pass
  them though a JTAG debugging chip, or somehow
  dont do that and get them to the proper data ports.
- USB-
- check that DM and DP are USB- and + (in datasheet)
- swapped all of the resisters in the input stages.
  they were the wrong values
- USB+
- (near R62) the data sheet seems to tell me that these
  bufferes are within the minimum Vcc supply
  voltage range of 3-30volts
- (near D3) THESE ARE PLACEHOLDER RESISTERS THAT WE WILL
  SWITCH WITH THE TVS's IN THE LATER STAGES!!!!!
- Autosport Connector
- JTAG Interface
- (near R66) 16 KHz filter
- 16 KHz filter
- (near R79) 16 KHz filter
- XDS100V2 CPLD
- (near R68) 16 KHz filter
- (near R78) 16 KHz filter
- Input Stages
- XDS100V2 FT2322HL

## Library data of the parts
C1-C4 C6 C9 C10 = CC0402: <B>CAPACITOR</B>, European symbol; SPICEMODEL: NONE; SPICEPREFIX: C; SpiceOrder 1: SpiceOrder 1; SpiceOrder 2: SpiceOrder 2
C5 = CPOL-EUCT3528: <B>POLARIZED CAPACITOR</B>, European symbol; +: +
C7 C8 C11-C19 C21-C25 C27-C45 C47-C50 = C-EUC0402: <B>CAPACITOR</B>, European symbol
C20 C26 = C-EUC0805: <B>CAPACITOR</B>, European symbol
C46 C56-C59 = CAP0805
C51-C55 C60-C72 = CAP0402
D1 = DIODE: <B>DIODE</B><p>
D2-D25 D30-D35 R41 R42 = RR0402: <B>RESISTOR</B>, European symbol; SPICEMODEL: NONE; SPICEPREFIX: R; SpiceOrder 1: SpiceOrder 1; SpiceOrder 2: SpiceOrder 2
D26-D29 = CHIP-LED
F1 = FUSE: <B>FUSE</B><p> / 5 x 20 mm
FB1 FB2 = INDUCTOR
H1-H4 = MOUNT-HOLE5.5: <b>MOUNTING HOLE</b> with drill center marker
IC1 IC2 = ISO1050DUB: <b>ISOLATED CAN TRANSCEIVER</b><p> / Source: http://focus.ti.com/lit/ds/symlink/iso1050.pdf; MPN: ISO1050DUBR; OC_FARNELL: 1755712; OC_NEWARK: 14R9899; GALVANIC ISOLATION: GALVANIC ISOLATION
LED1 = LED: <b>LED</b><p> / <u>OSRAM</u>:<br> / - <u>CHIPLED</u><br> / LG R971, LG N971, LY N971, LG Q971, LY Q971, LO R971, LY R971 / LH N974, LH R974<br> / LS Q976, LO Q976, LY Q976<br> / LO Q996<br> / - <u>Hyper CHIPLED</u><br> / LW Q18S<br> / LB Q993, LB Q99A, LB R99A<br> / - <u>SideLED</u><br> / LS A670, LO A670, LY A670, LG A670, LP A670<br> / LB A673, LV A673, LT A673, LW A673<br> / LH A674<br> / LY A675<br> / LS A676, LA A676, LO A676, LY A676, LW A676<br> / LS A679, LY A679, LG A679<br> / -  <u>Hyper Micro SIDELED®</u><br> / LS Y876, LA Y876, LO Y876, LY Y876<br> / LT Y87S<br> / - <u>SmartLED</u><br> / LW L88C, LW L88S<br> / LB L89C, LB L89S, LG L890<br> / LS L89K, LO L89K, LY L89K<br> / LS L896, LA L896, LO L896, LY L896<br> / - <u>TOPLED</u><br> / LS T670, LO T670, LY T670, LG T670, LP T670<br> / LSG T670, LSP T670, LSY T670, LOP T670, LYG T670<br> / LG T671, LOG T671, LSG T671<br> / LB T673, LV T673, LT T673, LW T673<br> / LH T674<br> / LS T676, LA T676, LO T676, LY T676, LB T676, LH T676, LSB T676, LW T676<br> / LB T67C, LV T67C, LT T67C, LS T67K, LO T67K, LY T67K, LW E67C<br> / LS E67B, LA E67B, LO E67B, LY E67B, LB E67C, LV E67C, LT E67C<br> / LW T67C<br> / LS T679, LY T679, LG T679<br> / LS T770, LO T770, LY T770, LG T770, LP T770<br> / LB T773, LV T773, LT T773, LW T773<br> / LH T774<br> / LS E675, LA E675, LY E675, LS T675<br> / LS T776, LA T776, LO T776, LY T776, LB T776<br> / LHGB T686<br> / LT T68C, LB T68C<br> / - <u>Hyper Mini TOPLED®</u><br> / LB M676<br> / - <u>Mini TOPLED Santana®</u><br> / LG M470<br> / LS M47K, LO M47K, LY M47K / <p> / Source: http://www.osram.convergy.de<p> / <u>LUXEON:</u><br> / - <u>LUMILED®</u><br> / LXK2-PW12-R00, LXK2-PW12-S00, LXK2-PW14-U00, LXK2-PW14-V00<br> / LXK2-PM12-R00, LXK2-PM12-S00, LXK2-PM14-U00<br> / LXK2-PE12-Q00, LXK2-PE12-R00, LXK2-PE12-S00, LXK2-PE14-T00, LXK2-PE14-U00<br> / LXK2-PB12-K00, LXK2-PB12-L00, LXK2-PB12-M00, LXK2-PB14-N00, LXK2-PB14-P00, LXK2-PB14-Q00<br> / LXK2-PR12-L00, LXK2-PR12-M00, LXK2-PR14-Q00, LXK2-PR14-R00<br> / LXK2-PD12-Q00, LXK2-PD12-R00, LXK2-PD12-S00<br> / LXK2-PH12-R00, LXK2-PH12-S00<br> / LXK2-PL12-P00, LXK2-PL12-Q00, LXK2-PL12-R00 / <p> / Source: www.luxeon.com<p> / <u>KINGBRIGHT:</U><p> / KA-3528ASYC<br> / Source: www.kingbright.com
Q1 Q3 = PMOSSOT23: <b>MOS FET</b>; OC_FARNELL: unknown; OC_NEWARK: unknown
R1-R3 R5-R40 R43-R59 R61-R79 R81-R84 = R-US_R0402: <B>RESISTOR</B>, American symbol
R4 = VARISTORCN0805: <b>VARISTOR</b>
R86 R89-R115 = RES0402
SV2 = FE15-2: <b>FEMALE HEADER</b>; OC_FARNELL: unknown; OC_NEWARK: unknown
TP1 = TPSB1,27: <b>TEST PIN</b>
U1 U3-U6 U8 = LM324PW: IC QUAD OP AMP; MPN: LM324PW; OC_FARNELL: 8389241; OC_NEWARK: 38K3709; PACKAGE: 14-TSSOP; SUPPLIER: Texas Instruments
U2 = TPS70445_PWP_24: MANUFACTURER: Texas Instruments; DESCRIPTION: Dual-output (3.3V/1.2V)1A/2A LDO Regulator with dual enables and SVS for split-voltage systems; FAMILY_NAME: DUAL CHANNEL LDO; INDUSTRY_STD_PKG_TYPE: HTSSOP; PACKAGE_DESIGNATOR: PWP; PIN_COUNT: 24; DATASHEETURL: http://www.ti.com/lit/gpn/TPS70445; GENERIC_PART_NUMBER: TPS70445; MANUFACTURER_PART_NUMBER: tps70445_pwp_24; VENDOR: Texas Instruments
U7 = RM42L432_PZ_100RM42L432_PZ_100: VENDOR: TEXAS INSTRUMENTS; MANUFACTURER_PART_NUMBER: rm42l432_pz_100
U$5 = USB-CON-5PIN-105017-0001: <b> Molex Micro USB 105017-0001</b>
X1 = AS14-35: <b>DEUTSCH Connector</b>; OC_FARNELL: unknown; OC_NEWARK: unknown
XTAL1 = 7M-16.000MAAJ-T: CRYSTAL SEAM, 16MHZ, 18PF, SMD; MPN: 7M-16.000MAAJ-T; OC_FARNELL: 1842060; OC_NEWARK: 84R5710; PACKAGE: SMD; SUPPLIER: TXC; 1: 1; 3: 3
Y1 = CRYSTAL-SMD